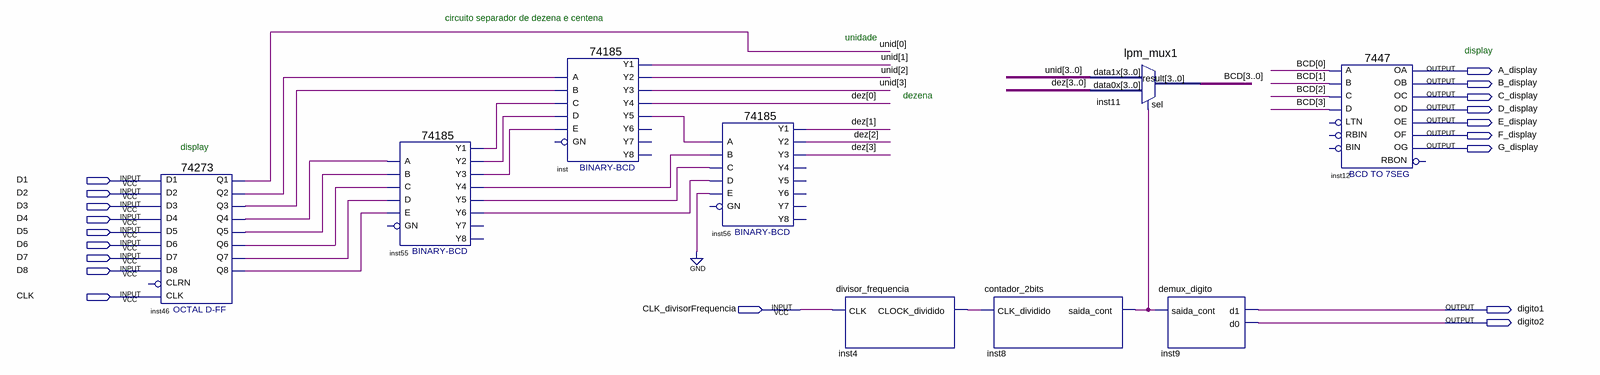
[diagram p0: schematic sheet]
// Quartus schematic exibir_display.bdf as structural Verilog: 9 symbols, 19 pins
module exibir_display (
  input  D1,
  input  D2,
  input  D3,
  input  D4,
  input  D5,
  input  D6,
  input  D7,
  input  D8,
  input  CLK,
  input  CLK_divisorFrequencia,
  output A_display,
  output B_display,
  output C_display,
  output D_display,
  output E_display,
  output F_display,
  output G_display,
  output digito1,
  output digito2
);

  wire inst4_clock_dividido, inst8_saida_cont, inst46_q2, inst46_q3, inst46_q4, inst46_q5, inst46_q6,
       inst46_q7, inst46_q8, inst55_y1, inst55_y2, inst55_y3, inst55_y4, inst55_y5, inst55_y6, inst_y5;
  wire [3:0] BCD, dez, unid;

  \74273  inst46 (
    .D2(D2), .D3(D3), .D1(D1), .D4(D4), .D7(D7), .D6(D6), .D5(D5), .D8(D8), .CLK(CLK), .Q4(inst46_q4),
    .Q1(unid[0]), .Q2(inst46_q2), .Q3(inst46_q3), .Q6(inst46_q6), .Q5(inst46_q5), .Q7(inst46_q7),
    .Q8(inst46_q8));  // open: CLRN
  \74185  inst55 (
    .A(inst46_q4), .B(inst46_q5), .D(inst46_q7), .C(inst46_q6), .E(inst46_q8), .Y1(inst55_y1),
    .Y3(inst55_y3), .Y2(inst55_y2), .Y5(inst55_y5), .Y4(inst55_y4), .Y6(inst55_y6));  // open: GN, Y8, Y7
  \74185  inst (
    .A(inst46_q2), .B(inst46_q3), .D(inst55_y2), .C(inst55_y1), .E(inst55_y3), .Y1(unid[1]), .Y3(unid[3]),
    .Y2(unid[2]), .Y5(inst_y5), .Y4(dez[0]));  // open: GN, Y6, Y8, Y7
  \74185  inst56 (
    .A(inst_y5), .B(inst55_y4), .D(inst55_y6), .C(inst55_y5), .E(1'b0), .Y1(dez[1]), .Y3(dez[3]), .Y2(dez[2]));  // open: GN, Y5, Y4, Y6, Y8, Y7
  divisor_frequencia inst4 (.CLK(CLK_divisorFrequencia), .CLOCK_dividido(inst4_clock_dividido));
  contador_2bits inst8 (.CLK_dividido(inst4_clock_dividido), .saida_cont(inst8_saida_cont));
  lpm_mux1 inst11 (.data1x(unid), .data0x(dez), .sel(inst8_saida_cont), .result(BCD));
  demux_digito inst9 (.saida_cont(inst8_saida_cont), .d1(digito1), .d0(digito2));
  \7447  inst12 (
    .B(BCD[1]), .C(BCD[2]), .D(BCD[3]), .A(BCD[0]), .OB(B_display), .OC(C_display), .OE(E_display),
    .OD(D_display), .OF(F_display), .OG(G_display), .OA(A_display));  // open: LTN, RBIN, BIN, RBON

  // Notes on the sheet:
  //   circuito separador de dezena e centena
  //   unidade
  //   display
  //   dezena
  //   display
endmodule
